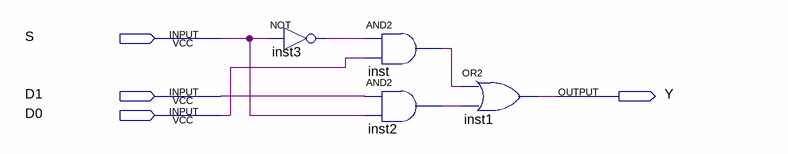
[diagram p0: schematic sheet]
// Quartus schematic MUX2.bdf as structural Verilog: 4 symbols, 4 pins
module MUX2 (
  input  S,
  input  D1,
  input  D0,
  output Y
);

  wire inst2_out, inst3_out, inst_out;

  not inst3 (inst3_out, S);
  and inst (inst_out, inst3_out, D0);
  and inst2 (inst2_out, D1, S);
  or inst1 (Y, inst_out, inst2_out);
endmodule
